# Altium schematic sheet SolarPanelXPlus.SchDoc
size A
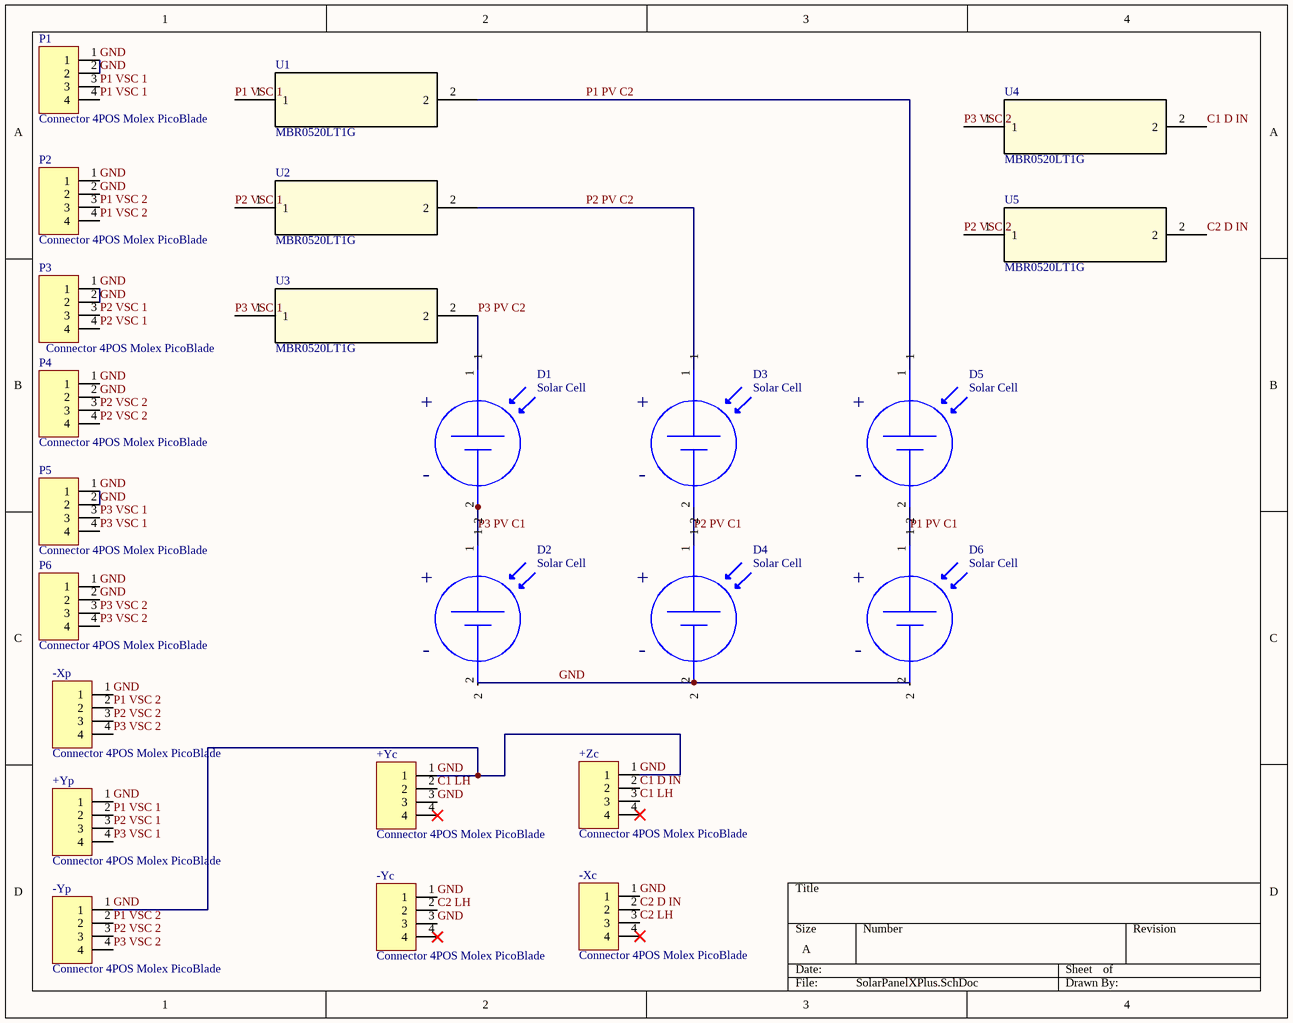
[diagram p0: SolarPanelXPlus.SchDoc]

## Parts
+Yc  Connector 4POS Molex PicoBlade  [532610471]
+Yp  Connector 4POS Molex PicoBlade  [532610471]
+Zc  Connector 4POS Molex PicoBlade  [532610471]
-Xc  Connector 4POS Molex PicoBlade  [532610471]
-Xp  Connector 4POS Molex PicoBlade  [532610471]
-Yc  Connector 4POS Molex PicoBlade  [532610471]
-Yp  Connector 4POS Molex PicoBlade  [532610471]
D1  Solar Cell  [SolAeroBJT]
D2  Solar Cell  [SolAeroBJT]
D3  Solar Cell  [SolAeroBJT]
D4  Solar Cell  [SolAeroBJT]
D5  Solar Cell  [SolAeroBJT]
D6  Solar Cell  [SolAeroBJT]
P1  Connector 4POS Molex PicoBlade  [532610471]
P2  Connector 4POS Molex PicoBlade  [532610471]
P3  Connector 4POS Molex PicoBlade  [532610471]
P4  Connector 4POS Molex PicoBlade  [532610471]
P5  Connector 4POS Molex PicoBlade  [532610471]
P6  Connector 4POS Molex PicoBlade  [532610471]
U1  MBR0520LT1G  [SOD-123]
U2  MBR0520LT1G  [SOD-123]
U3  MBR0520LT1G  [SOD-123]
U4  MBR0520LT1G  [SOD-123]
U5  MBR0520LT1G  [SOD-123]

## Nets
C1 D IN: +Zc.2 U4.2
C1 LH: +Yc.2 +Zc.3
C2 D IN: -Xc.2 U5.2
C2 LH: -Xc.3 -Yc.2
GND: +Yc.1 +Yc.3 +Yp.1 +Zc.1 -Xc.1 -Xp.1 -Yc.1 -Yc.3 -Yp.1 D2.2 D4.2 D6.2 P1.1 P1.2 P2.1 P2.2 P3.1 P3.2 P4.1 P4.2 P5.1 P5.2 P6.1 P6.2
P1 PV C1: D5.2 D6.1
P1 PV C2: D5.1 U1.2
P1 VSC 1: +Yp.2 P1.3 P1.4 U1.1
P1 VSC 2: -Xp.2 -Yp.2 P2.3 P2.4
P2 PV C1: D3.2 D4.1
P2 PV C2: D3.1 U2.2
P2 VSC 1: +Yp.3 P3.3 P3.4 U2.1
P2 VSC 2: -Xp.3 -Yp.3 P4.3 P4.4 U5.1
P3 PV C1: D1.2 D2.1
P3 PV C2: D1.1 U3.2
P3 VSC 1: +Yp.4 P5.3 P5.4 U3.1
P3 VSC 2: -Xp.4 -Yp.4 P6.3 P6.4 U4.1

Not connected (* = marked no-connect by the designer): +Yc 4*; +Zc 4*; -Xc 4*; -Yc 4*

## Notes on the sheet
- (in symbol SolAeroBJT1) +; -

## Library data of the parts
+Yc +Yp +Zc -Xc -Xp -Yc -Yp P1-P6 = 532610471
D1-D6 = SolAeroBJT1: SolAero BJT Space Solar Cell
U1-U5 = MBR0520LT1G: Imported; Vendor: ON Semiconductor; C: Copyright (C) 2015 Accelerated Designs. All rights reserved; Manufacturer_Part_Number: MBR0520LT1G; Copyright: Copyright (C) 2015 Accelerated Designs. All rights reserved; Value: Value; Type: Type; RefDes: RefDes